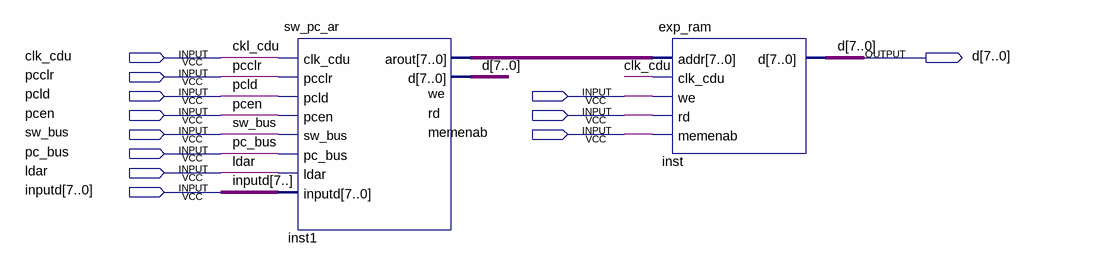
[diagram p0: schematic sheet]
// Quartus schematic pc_ram.bdf as structural Verilog: 2 symbols, 12 pins
module pc_ram (
  input  clk_cdu,
  input  pcclr,
  input  pcld,
  input  we,
  input  pcen,
  input  rd,
  input  sw_bus,
  input  memenab,
  input  pc_bus,
  input  ldar,
  input  [7:0] inputd,
  output [7:0] d
);

  wire \inputd[7..] ;
  wire [7:0] inst1_arout;

  sw_pc_ar inst1 (
    .clk_cdu(clk_cdu), .pcclr(pcclr), .pcld(pcld), .pcen(pcen), .sw_bus(sw_bus), .pc_bus(pc_bus),
    .ldar(ldar), .inputd({8{\inputd[7..] }}), .arout(inst1_arout), .d(d));
  exp_ram inst (.addr(inst1_arout), .clk_cdu(clk_cdu), .we(we), .rd(rd), .memenab(memenab), .d(d));

  // Other names for the same wires on the sheet: ckl_cdu = clk_cdu
endmodule
